# Altium schematic sheet UART_Level_Shift.SchDoc: FIoT Rev 2.0
size A4; ApprovedBy: PM; CheckedBy: PM; Author: PM; CompanyName: -; DrawnBy: PM; Engineer: AG; DocumentNumber: 18072022 - 1; Revision: 0; SheetNumber: 2; SheetTotal: 8; CHK_APP_DATE: --/--/--
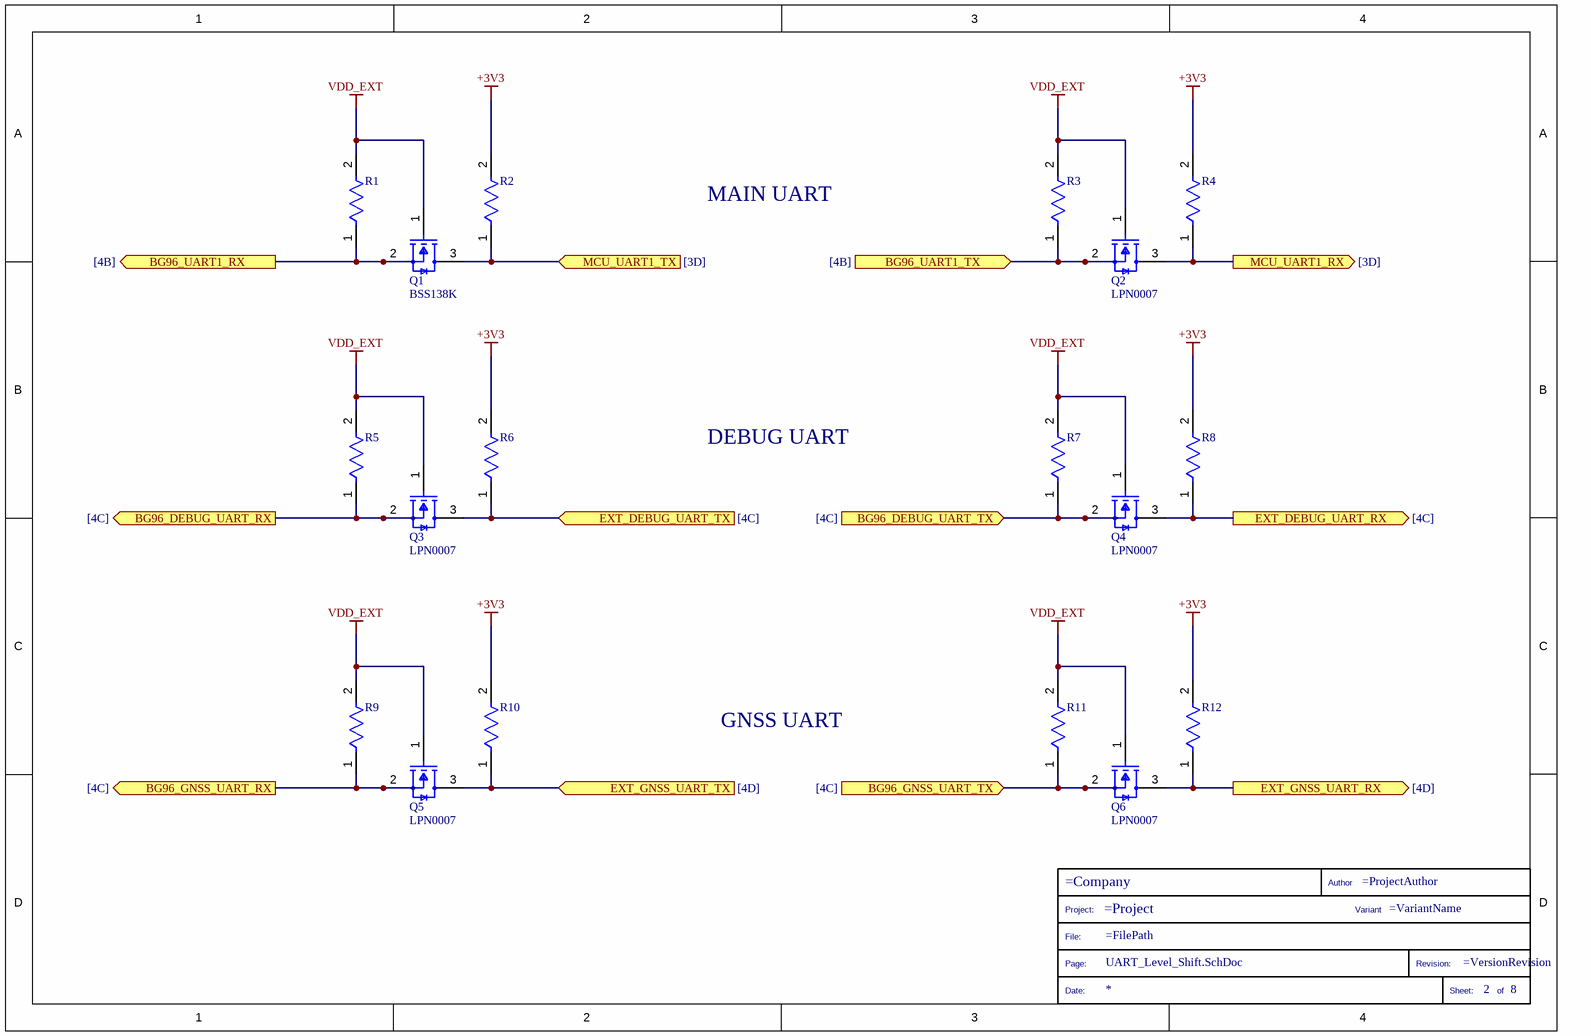
[diagram p0: UART_Level_Shift.SchDoc]

## Parts
*?  TitleBlock  (value not drawn)  (graphical)
Q1  BSS138K  [FP-318-08-IPC_B]
Q2  LPN0007  [FP-318-08-IPC_B]
Q3  LPN0007  [FP-318-08-IPC_B]
Q4  LPN0007  [FP-318-08-IPC_B]
Q5  LPN0007  [FP-318-08-IPC_B]
Q6  LPN0007  [FP-318-08-IPC_B]
R1  0402WGF1002TCE  [FP-CRCW0402-e3-MFG]  (value not drawn)
R2  0402WGF1002TCE  [FP-CRCW0402-e3-MFG]  (value not drawn)
R3  0402WGF1002TCE  [FP-CRCW0402-e3-MFG]  (value not drawn)
R4  0402WGF1002TCE  [FP-CRCW0402-e3-MFG]  (value not drawn)
R5  0402WGF1002TCE  [FP-CRCW0402-e3-MFG]  (value not drawn)
R6  0402WGF1002TCE  [FP-CRCW0402-e3-MFG]  (value not drawn)
R7  0402WGF1002TCE  [FP-CRCW0402-e3-MFG]  (value not drawn)
R8  0402WGF1002TCE  [FP-CRCW0402-e3-MFG]  (value not drawn)
R9  0402WGF1002TCE  [FP-CRCW0402-e3-MFG]  (value not drawn)
R10  0402WGF1002TCE  [FP-CRCW0402-e3-MFG]  (value not drawn)
R11  0402WGF1002TCE  [FP-CRCW0402-e3-MFG]  (value not drawn)
R12  0402WGF1002TCE  [FP-CRCW0402-e3-MFG]  (value not drawn)

## Ports
BG96_DEBUG_UART_RX (out, see [4C]), BG96_DEBUG_UART_TX (in, see [4C]), BG96_GNSS_UART_RX (out, see [4C]), BG96_GNSS_UART_TX (in, see [4C]), BG96_UART1_RX (out, see [4B]), BG96_UART1_TX (in, see [4B]), EXT_DEBUG_UART_RX (out, see [4C]), EXT_DEBUG_UART_TX (in, see [4C]), EXT_GNSS_UART_RX (out, see [4D]), EXT_GNSS_UART_TX (in, see [4D]), MCU_UART1_RX (out, see [3D]), MCU_UART1_TX (in, see [3D])

## Nets
+3V3: R2.2 R4.2 R6.2 R8.2 R10.2 R12.2
VDD_EXT: Q1.1(G) Q2.1(G) Q3.1(G) Q4.1(G) Q5.1(G) Q6.1(G) R1.2 R3.2 R5.2 R7.2 R9.2 R11.2
BG96_DEBUG_UART_RX: Q3.2(S) R5.1 ; port BG96_DEBUG_UART_RX
BG96_DEBUG_UART_TX: Q4.2(S) R7.1 ; port BG96_DEBUG_UART_TX
BG96_GNSS_UART_RX: Q5.2(S) R9.1 ; port BG96_GNSS_UART_RX
BG96_GNSS_UART_TX: Q6.2(S) R11.1 ; port BG96_GNSS_UART_TX
BG96_UART1_RX: Q1.2(S) R1.1 ; port BG96_UART1_RX
BG96_UART1_TX: Q2.2(S) R3.1 ; port BG96_UART1_TX
EXT_DEBUG_UART_RX: Q4.3(D) R8.1 ; port EXT_DEBUG_UART_RX
EXT_DEBUG_UART_TX: Q3.3(D) R6.1 ; port EXT_DEBUG_UART_TX
EXT_GNSS_UART_RX: Q6.3(D) R12.1 ; port EXT_GNSS_UART_RX
EXT_GNSS_UART_TX: Q5.3(D) R10.1 ; port EXT_GNSS_UART_TX
MCU_UART1_RX: Q2.3(D) R4.1 ; port MCU_UART1_RX
MCU_UART1_TX: Q1.3(D) R2.1 ; port MCU_UART1_TX

## Notes on the sheet
- MAIN UART
- DEBUG UART
- GNSS UART
- DWG. NO.
- REV.
- SHT.
- THIS DOCUMENT AND THE DATA DISCLOSED HEREIN OR HEREWITH IS THE PROPERTY OF ALTIUM LIMITED AND MAY BE FREELY DISTRIBUTED IN WHOLE. NO RIGHTS ARE RESERVED OR EXPRESS OR IMPLIED WARANTEE GIVEN.
- REVISION
- DESCRIPTION
- DATE
- APPROVED
- ENG:
- APPROVALS
- PROJECT
- DSN:
- CHK:
- REFERENCE DOCUMENTS
- PROJECT REVISION:
- TITLE
- DOCUMENT REVISION:
- DESIGN ITEM:
- BOM:
- FAB DWG:
- PCB DWG:
- ASSY DWG:
- SCALE:
- SIZE
- B
- CAGE CODE
- FILE NAME
- DWG NO.
- SHEET
- OF
- REV
- (in symbol TitleBlock) Author; Project:; Variant; File:; Page:; Revision:; Date:; Sheet:; of

## Library data of the parts
Q1-Q6 = LPN0007: MOSFET N-CH 50V 220MA SOT-23; Manufacturer 1: ON Semiconductor / Fairchild; Manufacturer Part Number 1: BSS138; Supplier 1: Digi-Key; Supplier Part Number 1: BSS138K-13DICT-ND; Lumen Part Number: LPN0007
R1-R12 = LPN0003: Res Thick Film 0402 10K Ohm 1% 0.063W; Manufacturer 1: Vishay Dale; Manufacturer Part Number 1: CRCW04021K00FKED; Supplier 1: Mouser; Supplier Part Number 1: 303-0402WGF1002TCE; Lumen Part Number: LPN0003